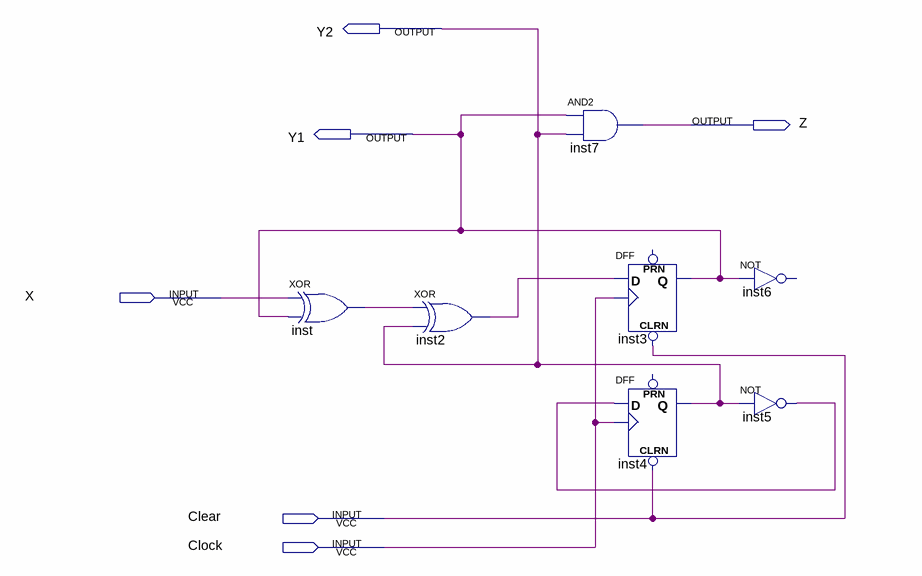
[diagram p0: schematic sheet]
// Quartus schematic homeworkProb.bdf as structural Verilog: 7 symbols, 6 pins
module homeworkProb (
  input  X,
  input  Clear,
  input  Clock,
  output Y2,
  output Z,
  output Y1
);

  wire inst2_out, inst5_out, inst_out;

  xor inst (inst_out, X, Y1);
  xor inst2 (inst2_out, inst_out, Y2);
  and inst7 (Z, Y1, Y2);
  DFF inst3 (.CLRN(Clear), .CLK(Clock), .D(inst2_out), .Q(Y1));  // open: PRN
  DFF inst4 (.CLRN(Clear), .CLK(Clock), .D(inst5_out), .Q(Y2));  // open: PRN
  // NOT inst6 has open pins: IN=Y1, OUT=open
  not inst5 (inst5_out, Y2);
endmodule
